# Altium project plataMedcontrol.PrjPcb
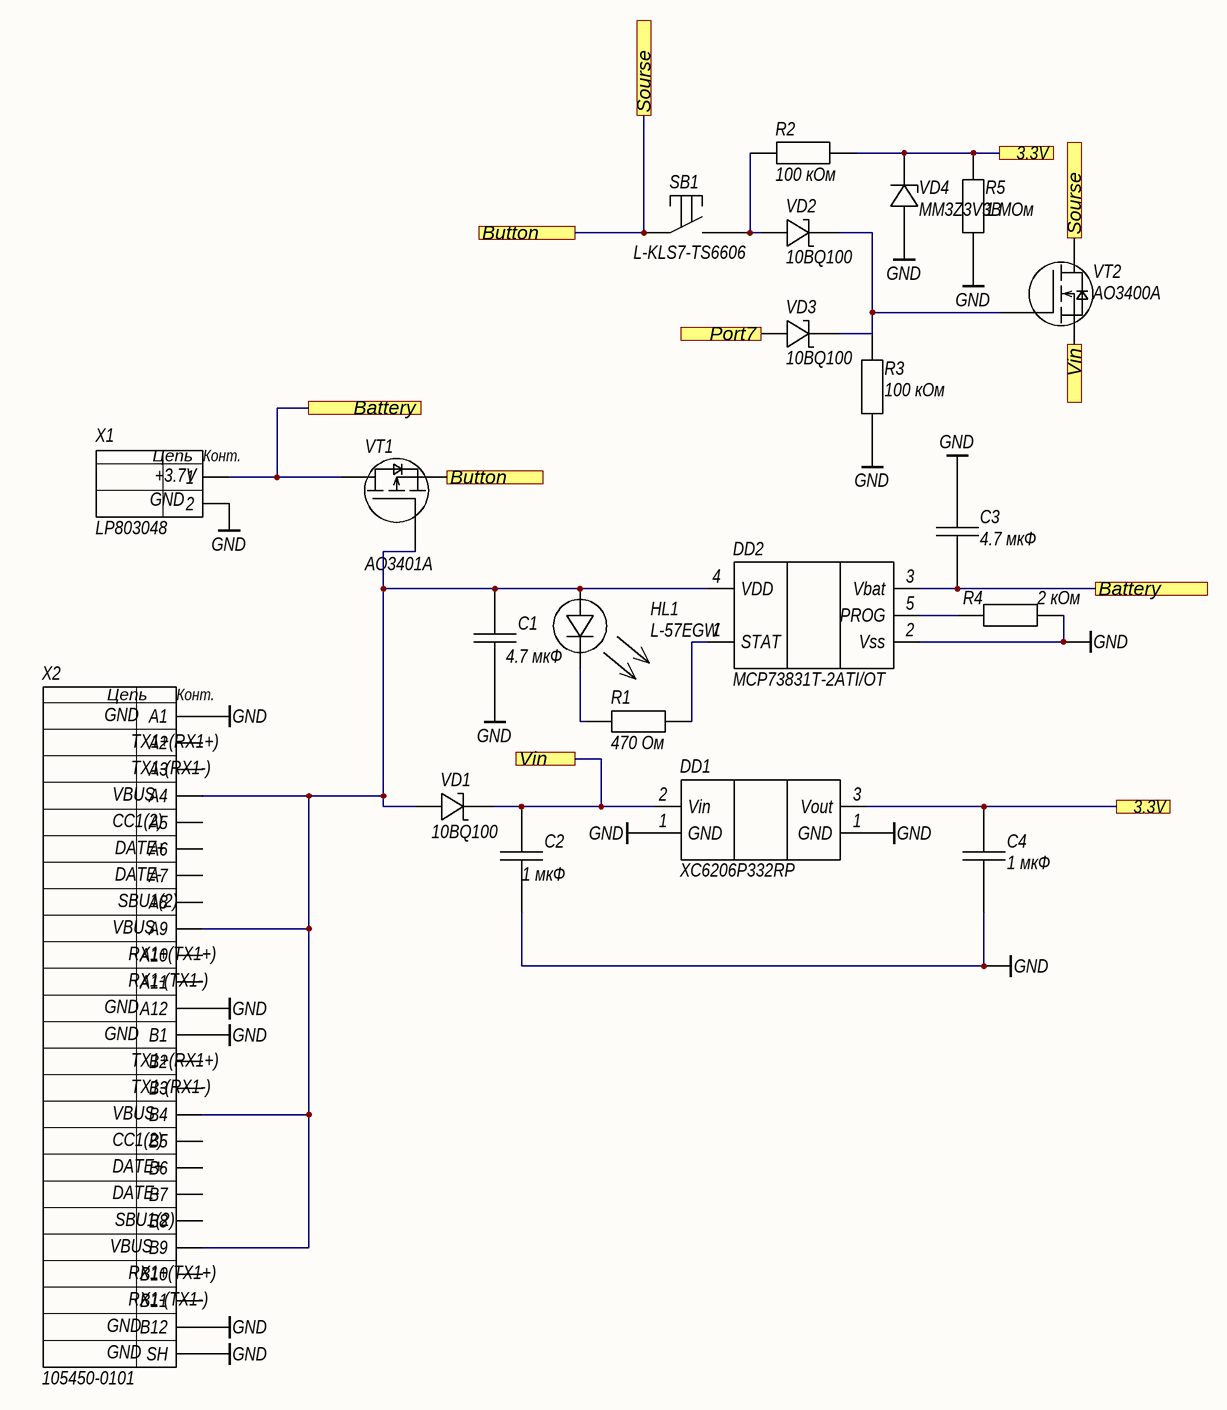
[diagram p0: Sheet1.SchDoc]
4 sheets, 62 parts. Net scope: flat (ports and power ports of the same name join across sheets).
Board files: PCB1.PcbDoc, PCB2_DATCHIKI.PcbDoc, PCB2_Plata.PcbDoc, PCB3_Datchiki.PcbDoc
Sheets:
  Sheet1.SchDoc
  Sheet2_datciki.SchDoc
  Sheet3_mk.SchDoc
  Sheet_FUNC.SchDoc

## Sheet Sheet1.SchDoc
size 420 x 297 mm; Address1: Address1; Address2: Address2; Address3: Address3; Address4: Address4; SheetNumber: 1; Scale: 1:1; Разраб.: Иванов; Обозначение документа: АБВГ.123456.001 Э3; Пров.: Петров; Утв.: Сидоров; Наименование организации: ОАО "Ваша фирма"; Перв. применение: АБВГ.123456.000; Наименование изделия 1: Плата; Наименование изделия 2: Схема электрическая; Наименование изделия 3: принципиальная; Нач. отд.: Нач. отд.; Фамилия нач. отд.: Сидоров; PageSetup: Record=PageOptions|CenterHorizontal=True|CenterVertical=True|PrintScale=0.94|XCorrection=1.00|YCorrection=1.00|PrintKind=1|BorderSize=5000000|LeftOffset=0|BottomOffset=0|Orientation=1|PaperLength=1000|PaperWidth=1000|Scale=100|PaperSource=7|PrintQuality=-4|MediaType=1|DitherType=10|PaperKind=A4|PrintScaleMode=1; DecimalNumber: Децимальный номер; HeadOfSector: Нач. сектора; MainDevice: Перв.примен.; Name: Наименование

### Parts
C1  4.7 мкФ  [CAP_0805]
C2  1 мкФ  [CAP_0805]
C3  4.7 мкФ  [CAP_0805]
C4  1 мкФ  [CAP_0805]
DD1  XC6206P332RP  [SOT-89]
DD2  MCP73831T-2ATI/OT  [SOT-23-5]
HL1  L-57EGW  [LED]
R1  470 Ом  [RES_0603]
R2  100 кОм  [RES_0603]
R3  100 кОм  [RES_0603]
R4  2 кОм  [RES_0603]
R5  1 МОм  [RES_0603]
SB1  L-KLS7-TS6606  [Button]
VD1  10BQ100  [SMB(DIODE)]
VD2  10BQ100  [SMB(DIODE)]
VD3  10BQ100  [SMB(DIODE)]
VD4  MM3Z3V3B  [SOD-323F]
VT1  AO3401A  [SOT-23-3]
VT2  AO3400A  [SOT-23-3]
X1  LP803048  [Raziem2_3mm]
X2  105450-0101  [USB-C]

### Ports
3.3V, Battery, Button, Port7, Sourse, Vin

### Nets
GND: C1.2 C2.2 C3.1 C4.2 DD1.1(GND) DD2.2(Vss) R3.1 R4.2 R5.1 VD4.A X1.2 X2.A1 X2.A12 X2.B1 X2.B12 X2.SH
NetC1_1: C1.1 DD2.4(VDD) HL1.A VD1.A VT1.GATE X2.A4 X2.A9 X2.B4 X2.B9
NetC2_1: C2.1 DD1.2(Vin) VD1.K VT2.SOURCE ; port Vin
NetC3_2: C3.2 DD2.3(Vbat) VT1.DRAIN X1.1 ; port Battery
NetC4_1: C4.1 DD1.3(Vout) R2.2 R5.2 VD4.K ; port 3.3V
NetDD2_1: DD2.1(STAT) R1.2
NetDD2_5: DD2.5(PROG) R4.1
NetDD4_10: VD3.A ; port Port7
NetHL1_K: HL1.K R1.1
NetR2_1: R2.1 SB1.2 VD2.A
NetR3_2: R3.2 VD2.K VD3.K VT2.GATE
NetSB1_1: SB1.1 VT1.SOURCE VT2.DRAIN ; port Sourse, port Button

Not connected (* = marked no-connect by the designer): X2 A2 A3 A5 A6 A7 A8 A10 A11 B2 B3 B5 B6 B7 B8 B10 B11

### Notes on the sheet
- Перв.примен.
- Справ.№
- Подп. и дата
- Инв.№ дубл.
- Взам.инв.№
- Подп.и дата
- Разраб.
- Изм.
- Лист
- № докум.
- Подп.
- Дата
- Лит.
- Масштаб
- Масса
- Т.контр.
- Пров.
- СХЕМА   ЭЛЕКТРИЧЕСКАЯ
- ПРИНЦИПИАЛЬНАЯ
- Листов
- Инв.№ подл.
- Утв.
- Н.контр.
- Нач.сект.
- Формат  A3
- (in symbol Raziem_2KONTKTA) Цепь; Конт.; +3.7V; GND
- (in symbol Raziem_USB-C) Цепь; Конт.; GND; TX1+(RX1+); TX1-(RX1-); VBUS; CC1(2); DATE+; DATE-; SBU1(2); RX1+(TX1+); RX1-(TX1-)

### Library data of the parts
C1-C4 = Condensator
  C1 C3: Value: 4.7 мкФ
  C2 C4: Value: 1 мкФ
DD1 = Stability_power: Name: XC6206P332RP
DD2 = Control_batery: Name: MCP73831T-2ATI/OT
HL1 = Svetodiode: Color: L-57EGW; Name: L-57EGW
R1-R5 = Rezistor
  R1: Value: 470 Ом
  R2 R3: Value: 100 кОм
  R4: Value: 2 кОм
  R5: Value: 1 МОм
SB1 = Button: Name: L-KLS7-TS6606
VD1-VD3 = Diode_SHOTKI: Name: 10BQ100
VD4 = Stabilitron: Name: MM3Z3V3B
VT1 = Polevoy_transistor_P_tip: Name: AO3401A
VT2 = Polevoy_transistor_N_tip: Name: AO3400A
X1 = Raziem_2KONTKTA: Name: LP803048
X2 = Raziem_USB-C: Name: 105450-0101

## Sheet Sheet2_datciki.SchDoc
size 420 x 297 mm; Address1: Address1; Address2: Address2; Address3: Address3; Address4: Address4; SheetNumber: 1; Scale: 1:1; Обозначение документа: АБВГ.123456.001 Э3
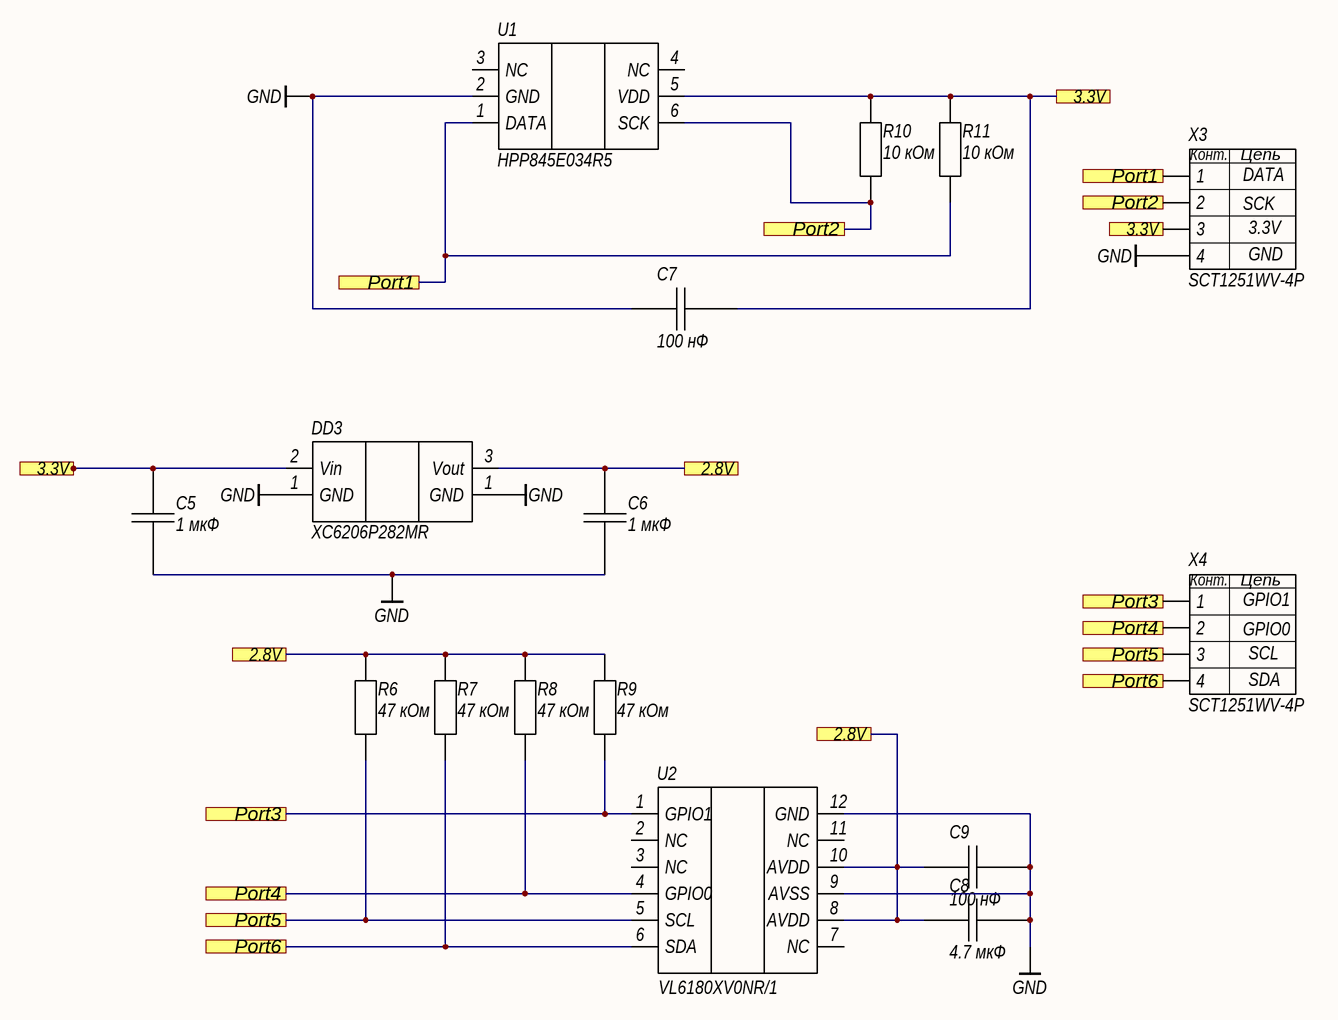
[diagram p1: Sheet2_datciki.SchDoc]

### Parts
C5  1 мкФ  [CAP_0805]
C6  1 мкФ  [CAP_0805]
C7  100 нФ  [CAP_0805]
C8  4.7 мкФ  [CAP_0805]
C9  100 нФ  [CAP_0805]
DD3  XC6206P282MR  [SOT-23-3_STAB_POWER]
R6  47 кОм  [RES_0603]
R7  47 кОм  [RES_0603]
R8  47 кОм  [RES_0603]
R9  47 кОм  [RES_0603]
R10  10 кОм  [RES_0603]
R11  10 кОм  [RES_0603]
U1  HPP845E034R5  [HTU20D(F)]
U2  VL6180XV0NR/1  [SOP12]
X3  SCT1251WV-4P  [Raziem4(1)_1.25mm]
X4  SCT1251WV-4P  [Raziem4(1)_1.25mm]

### Ports
2.8V, 3.3V, Port1, Port2, Port3, Port4, Port5, Port6

### Nets
GND: C5.2 C6.2 C7.1 C8.2 C9.2 DD3.1(GND) U1.2(GND) U2.9(AVSS) U2.12(GND) X3.4
NetC4_1: C5.1 C7.2 DD3.2(Vin) R10.2 R11.2 U1.5(VDD) X3.3 ; port 3.3V
NetC6_1: C6.1 C8.1 C9.1 DD3.3(Vout) R6.2 R7.2 R8.2 R9.2 U2.8(AVDD) U2.10(AVDD) ; port 2.8V
NetDD4_4: R11.1 U1.1(DATA) X3.1 ; port Port1
NetDD4_5: R10.1 U1.6(SCK) X3.2 ; port Port2
NetDD4_6: R9.1 U2.1(GPIO1) X4.1 ; port Port3
NetDD4_7: R8.1 U2.4(GPIO0) X4.2 ; port Port4
NetDD4_8: R6.1 U2.5(SCL) X4.3 ; port Port5
NetDD4_9: R7.1 U2.6(SDA) X4.4 ; port Port6

Not connected (* = marked no-connect by the designer): U1 3(NC) 4(NC); U2 2(NC) 3(NC) 7(NC) 11(NC)

### Notes on the sheet
- Подп. и дата
- Инв. № дубл.
- Взам. инв. №
- Инв. № подл.
- Изм.
- Лист
- № докум.
- Подп.
- Дата
- Копировал
- Формат А3
- (in symbol Raziem_4KONTKTA) Конт.; Цепь; GPIO1; GPIO0; SCL; SDA
- (in symbol Raziem_4KONTKTA_1) Конт.; Цепь; DATA; SCK; 3.3V; GND

### Library data of the parts
C5-C9 = Condensator
  C5 C6: Value: 1 мкФ
  C7 C9: Value: 100 нФ
  C8: Value: 4.7 мкФ
DD3 = Stability_power: Name: XC6206P282MR
R6-R11 = Rezistor
  R6-R9: Value: 47 кОм
  R10 R11: Value: 10 кОм
U1 = Datchik_vlaj_temp: Name: HPP845E034R5
U2 = Datchik_osvet: Name: VL6180XV0NR/1
X3 = Raziem_4KONTKTA_1: Name: SCT1251WV-4P
X4 = Raziem_4KONTKTA: Name: SCT1251WV-4P

## Sheet Sheet3_mk.SchDoc
size 420 x 297 mm; Address1: Address1; Address2: Address2; Address3: Address3; Address4: Address4; SheetNumber: 1; Scale: 1:1; Обозначение документа: АБВГ.123456.001 Э3
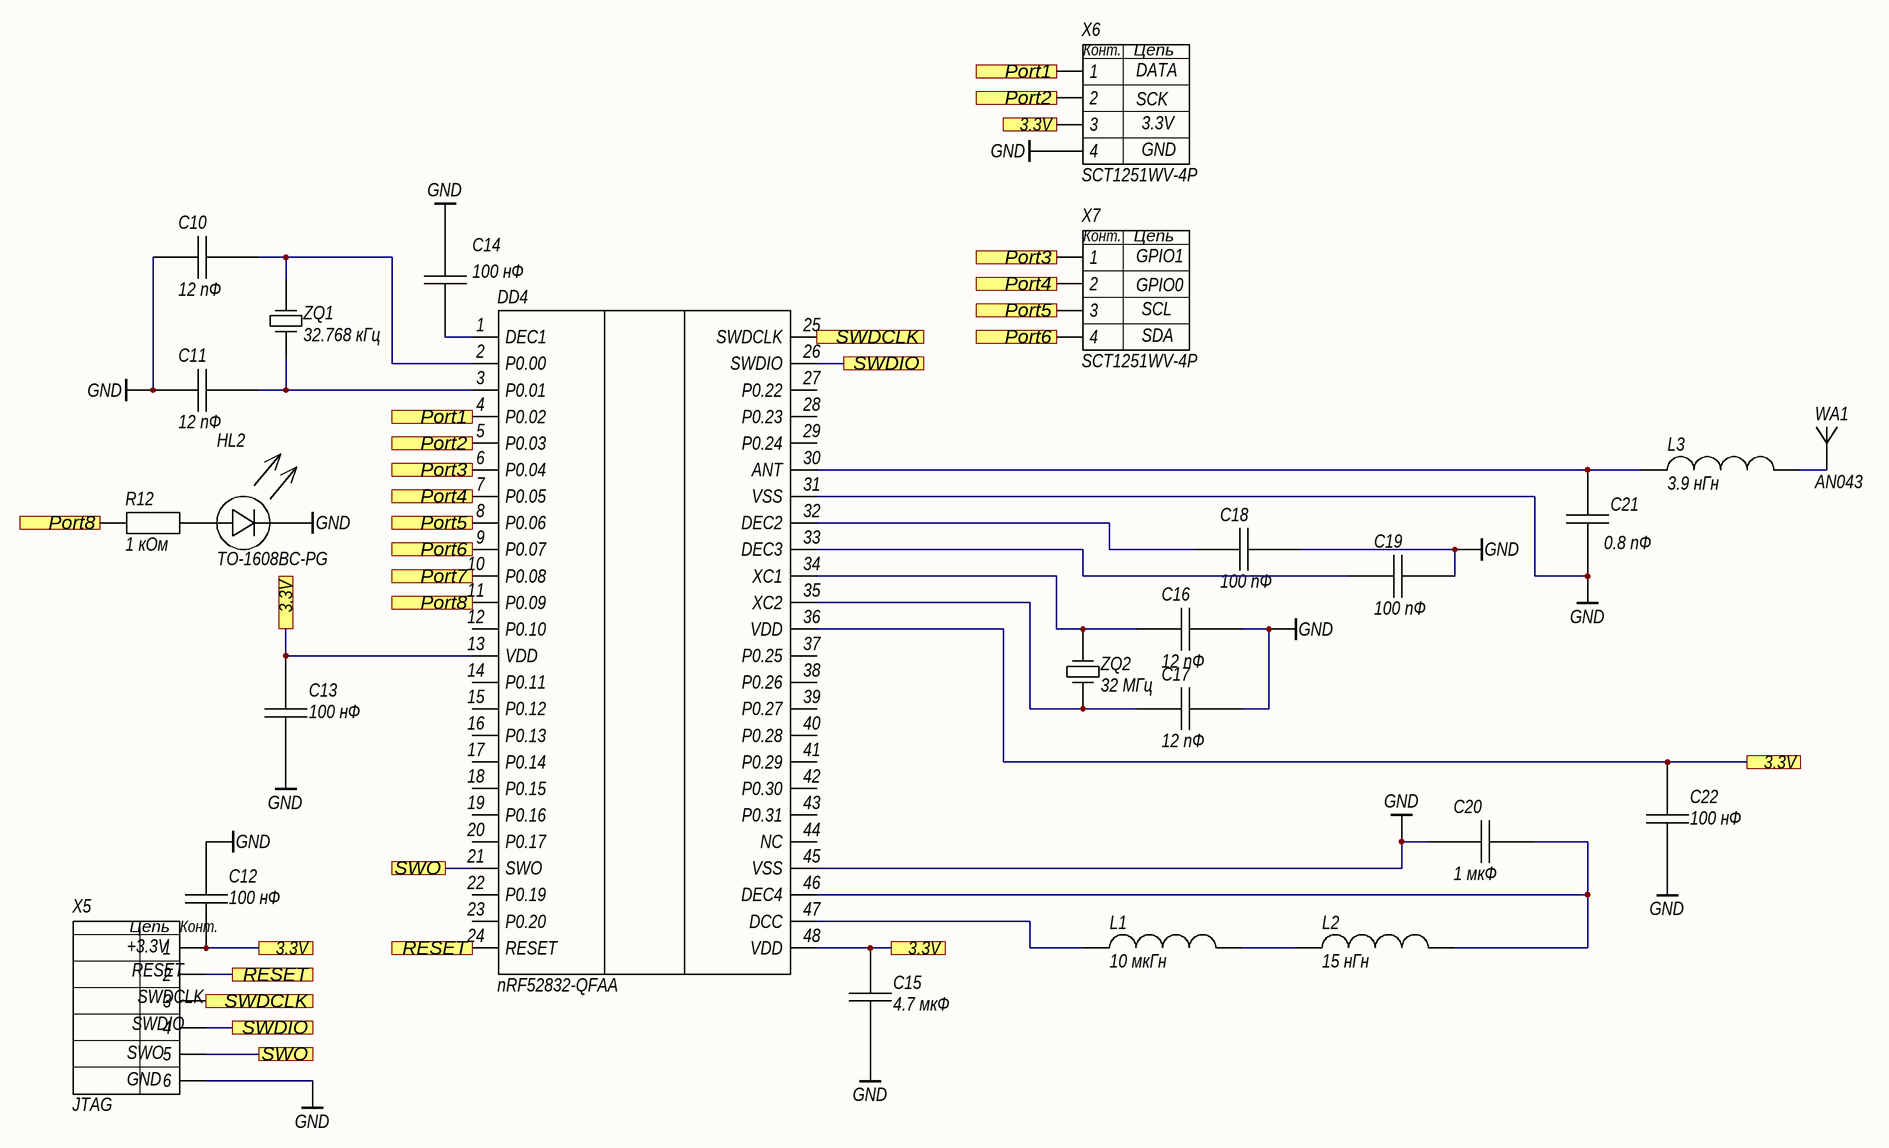
[diagram p2: Sheet3_mk.SchDoc]

### Parts
C10  12 пФ  [CAP_0805]
C11  12 пФ  [CAP_0805]
C12  100 нФ  [CAP_0805]
C13  100 нФ  [CAP_0805]
C14  100 нФ  [CAP_0805]
C15  4.7 мкФ  [CAP_0805]
C16  12 пФ  [CAP_0805]
C17  12 пФ  [CAP_0805]
C18  100 пФ  [CAP_0805]
C19  100 пФ  [CAP_0805]
C20  1 мкФ  [CAP_0805]
C21  0.8 пФ  [CAP_0805]
C22  100 нФ  [CAP_0805]
DD4  nRF52832-QFAA  [QFN48_6X6]
HL2  TO-1608BC-PG  [LED_0603]
L1  10 мкГн  [INDICT_0603]
L2  15 нГн  [INDICT_0402]
L3  3.9 нГн  [INDICT_0603]
R12  1 кОм  [RES_0603]
WA1  AN043  [BLE_50_Ohm_2400 MHz]
X5  JTAG  [RAZIEM_6_2.54mm]
X6  SCT1251WV-4P  [Raziem4(1)_1.25mm]
X7  SCT1251WV-4P  [Raziem4(1)_1.25mm]
ZQ1  32.768 кГц  [QUARTZ(32.768)]
ZQ2  32 МГц  [QUARTZ(32)]

### Ports
3.3V, Port1, Port2, Port3, Port4, Port5, Port6, Port7, Port8, RESET, SWDCLK, SWDIO, SWO

### Nets
GND: C10.1 C11.1 C12.2 C13.1 C14.1 C15.2 C16.2 C17.2 C18.2 C19.2 C20.2 C21.2 C22.1 DD4.31(VSS) DD4.45(VSS) HL2.K X5.6 X6.4
NetC4_1: C12.1 C13.2 C15.1 C22.2 DD4.13(VDD) DD4.36(VDD) DD4.48(VDD) X5.1 X6.3 ; port 3.3V
NetC10_2: C10.2 DD4.2(P0.00) ZQ1.2
NetC11_2: C11.2 DD4.3(P0.01) ZQ1.1
NetC14_2: C14.2 DD4.1(DEC1)
NetC16_1: C16.1 DD4.34(XC1) ZQ2.2
NetC17_1: C17.1 DD4.35(XC2) ZQ2.1
NetC18_1: C18.1 DD4.32(DEC2)
NetC19_1: C19.1 DD4.33(DEC3)
NetC20_1: C20.1 DD4.46(DEC4) L2.2
NetC21_1: C21.1 DD4.30(ANT) L3.1
NetDD4_4: DD4.4(P0.02) X6.1 ; port Port1
NetDD4_5: DD4.5(P0.03) X6.2 ; port Port2
NetDD4_6: DD4.6(P0.04) X7.1 ; port Port3
NetDD4_7: DD4.7(P0.05) X7.2 ; port Port4
NetDD4_8: DD4.8(P0.06) X7.3 ; port Port5
NetDD4_9: DD4.9(P0.07) X7.4 ; port Port6
NetDD4_10: DD4.10(P0.08) ; port Port7
NetDD4_11: DD4.11(P0.09) R12.1 ; port Port8
NetDD4_21: DD4.21(SWO) X5.5 ; port SWO
NetDD4_24: DD4.24(RESET) X5.2 ; port RESET
NetDD4_25: DD4.25(SWDCLK) X5.3 ; port SWDCLK
NetDD4_26: DD4.26(SWDIO) X5.4 ; port SWDIO
NetDD4_47: DD4.47(DCC) L1.1
NetHL2_A: HL2.A R12.2
NetL1_2: L1.2 L2.1
NetL3_2: L3.2 WA1.1

Not connected (* = marked no-connect by the designer): DD4 12(P0.10) 14(P0.11) 15(P0.12) 16(P0.13) 17(P0.14) 18(P0.15) 19(P0.16) 20(P0.17) 22(P0.19) 23(P0.20) 27(P0.22) 28(P0.23) 29(P0.24) 37(P0.25) 38(P0.26) 39(P0.27) 40(P0.28) 41(P0.29) 42(P0.30) 43(P0.31) 44(NC)

### Notes on the sheet
- Подп. и дата
- Инв. № дубл.
- Взам. инв. №
- Инв. № подл.
- Изм.
- Лист
- № докум.
- Подп.
- Дата
- Копировал
- Формат А3
- (in symbol Raziem_4KONTKTA) Конт.; Цепь; GPIO1; GPIO0; SCL; SDA
- (in symbol Raziem_4KONTKTA_1) Конт.; Цепь; DATA; SCK; 3.3V; GND
- (in symbol Raziem_6KONTKT) Цепь; Конт.; +3.3V; RESET; SWDCLK; SWDIO; SWO; GND

### Library data of the parts
C10-C22 = Condensator
  C10 C11 C16 C17: Value: 12 пФ
  C12-C14 C22: Value: 100 нФ
  C15: Value: 4.7 мкФ
  C18 C19: Value: 100 пФ
  C20: Value: 1 мкФ
  C21: Value: 0.8 пФ
DD4 = Micro_Proc(nrf52832): Name: nRF52832-QFAA
HL2 = Svetodiode: Color: TO-1608BC-PG
L1-L3 = Induktivnost
  L1: Value: 10 мкГн
  L2: Value: 15 нГн
  L3: Value: 3.9 нГн
R12 = Rezistor: Value: 1 кОм
WA1 = Antena
X5 = Raziem_6KONTKT: Name: JTAG
X6 = Raziem_4KONTKTA_1: Name: SCT1251WV-4P
X7 = Raziem_4KONTKTA: Name: SCT1251WV-4P
ZQ1 ZQ2 = Kvarc_rezonator
  ZQ1: Name: 32.768 кГц
  ZQ2: Name: 32 МГц

## Sheet Sheet_FUNC.SchDoc
size A4
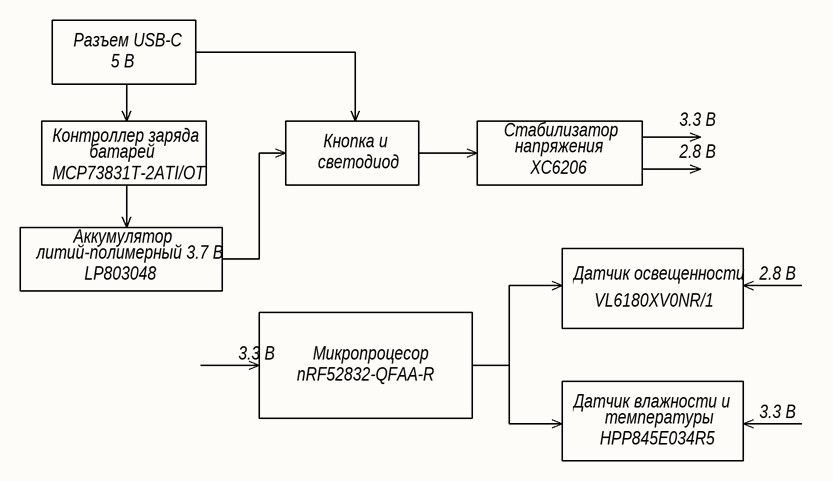
[diagram p3: Sheet_FUNC.SchDoc]

### Notes on the sheet
- Разъем USB-C
- 5 В
- 3.3 В
- Контроллер заряда
- MCP73831T-2ATI/OT
- батарей
- светодиод
- Кнопка и
- Стабилизатор
- напряжения
- XC6206
- 2.8 В
- литий-полимерный 3.7 В
- Аккумулятор
- LP803048
- Датчик освещенности
- VL6180XV0NR/1
- nRF52832-QFAA-R
- Микропроцесор
- Датчик влажности и
- HPP845E034R5
- температуры

## Nets that join several sheets
GND: Sheet1 (16 pins), Sheet2_datciki (10 pins), Sheet3_mk (18 pins)
NetC4_1: Sheet1 (5 pins), Sheet2_datciki (7 pins), Sheet3_mk (9 pins)
NetDD4_4: Sheet2_datciki (R11.1 U1.1 X3.1), Sheet3_mk (DD4.4 X6.1)
NetDD4_5: Sheet2_datciki (R10.1 U1.6 X3.2), Sheet3_mk (DD4.5 X6.2)
NetDD4_6: Sheet2_datciki (R9.1 U2.1 X4.1), Sheet3_mk (DD4.6 X7.1)
NetDD4_7: Sheet2_datciki (R8.1 U2.4 X4.2), Sheet3_mk (DD4.7 X7.2)
NetDD4_8: Sheet2_datciki (R6.1 U2.5 X4.3), Sheet3_mk (DD4.8 X7.3)
NetDD4_9: Sheet2_datciki (R7.1 U2.6 X4.4), Sheet3_mk (DD4.9 X7.4)
NetDD4_10: Sheet1 (VD3.A), Sheet3_mk (DD4.10)